# EAGLE design rapport (EAGLE 8.4.3)
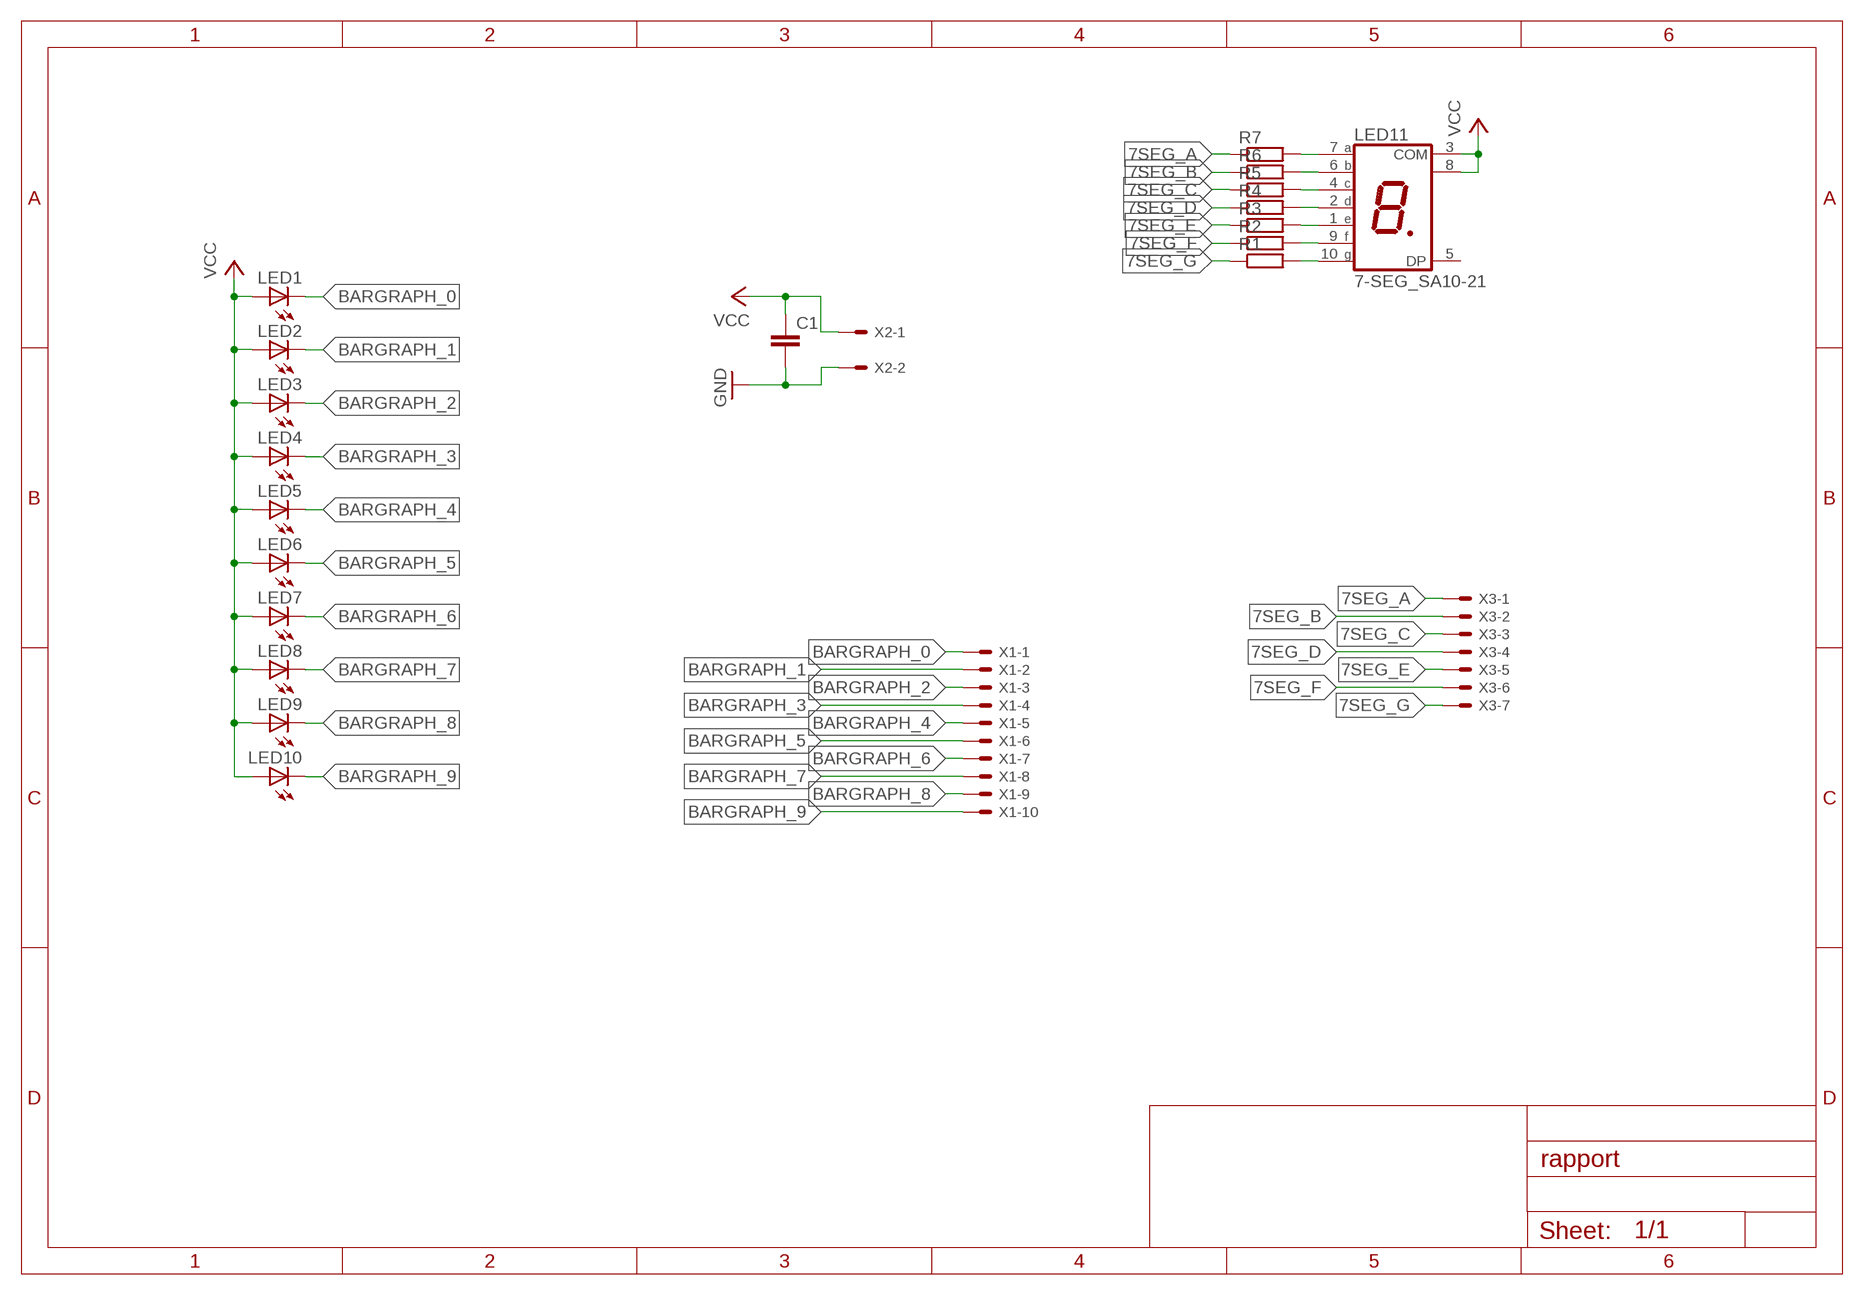
[diagram p0: schematic, sheet 1]

## Parts
C1  C-EU025-030X050  [C025-030X050]
LED1  LED5MM  [LED5MM]
LED2  LED5MM  [LED5MM]
LED3  LED5MM  [LED5MM]
LED4  LED5MM  [LED5MM]
LED5  LED5MM  [LED5MM]
LED6  LED5MM  [LED5MM]
LED7  LED5MM  [LED5MM]
LED8  LED5MM  [LED5MM]
LED9  LED5MM  [LED5MM]
LED10  LED5MM  [LED5MM]
LED11  7-SEG_SA10-21  [SA10-21]
R1  R-EU_0204/7  [0204/7]
R2  R-EU_0204/7  [0204/7]
R3  R-EU_0204/7  [0204/7]
R4  R-EU_0204/7  [0204/7]
R5  R-EU_0204/7  [0204/7]
R6  R-EU_0204/7  [0204/7]
R7  R-EU_0204/7  [0204/7]
X1  KK-156-10  [KK-156-10]
X2  KK-156-2  [KK-156-2]
X3  KK-156-7  [KK-156-7]

## Nets
7SEG_A: R7.1 X3.1
7SEG_B: R6.1 X3.2
7SEG_C: R5.1 X3.3
7SEG_D: R4.1 X3.4
7SEG_E: R3.1 X3.5
7SEG_F: R2.1 X3.6
7SEG_G: R1.1 X3.7
BARGRAPH_0: LED1.K(C) X1.1
BARGRAPH_1: LED2.K(C) X1.2
BARGRAPH_2: LED3.K(C) X1.3
BARGRAPH_3: LED4.K(C) X1.4
BARGRAPH_4: LED5.K(C) X1.5
BARGRAPH_5: LED6.K(C) X1.6
BARGRAPH_6: LED7.K(C) X1.7
BARGRAPH_7: LED8.K(C) X1.8
BARGRAPH_8: LED9.K(C) X1.9
BARGRAPH_9: LED10.K(C) X1.10
GND: C1.2 X2.2
N$2: LED11.7(A) R7.2
N$3: LED11.6(B) R6.2
N$4: LED11.4(C) R5.2
N$5: LED11.2(D) R4.2
N$6: LED11.1(E) R3.2
N$7: LED11.9(F) R2.2
N$8: LED11.10(G) R1.2
VCC: C1.1 LED1.A LED2.A LED3.A LED4.A LED5.A LED6.A LED7.A LED8.A LED9.A LED10.A LED11.3(COM) LED11.8(COM) X2.1
Unconnected: LED11.5(DP)

## Library data of the parts
C1 = rcl:C-EU: CAPACITOR, European symbol
LED1-LED10 = led:LED: LED OSRAM: - CHIPLED LG R971, LG N971, LY N971, LG Q971, LY Q971, LO R971, LY R971 LH N974, LH R974 LS Q976, LO Q976, LY Q976 LO Q996 - Hyper CHIPLED LW Q18S LB Q993, LB Q99A, LB R99A - SideLED LS A670, LO A670, LY A670, LG A670, LP A670 LB A673, LV A673, LT A673, LW A673 LH A674 LY A675 LS A676, LA A676, LO A676, LY A676, LW A676 LS A679, LY A679, LG A679 - Hyper Micro SIDELED® LS Y876, LA Y876, LO Y876, LY Y876 LT Y87S - SmartLED LW L88C, LW L88S LB L89C, LB L89S, LG L890 LS L89K, LO L89K, LY L89K LS L896, LA L896, LO L896, LY L896 - TOPLED LS T670, LO T670, LY T670, LG T670, LP T670 LSG T670, LSP T670, LSY T670, LOP T670, LYG T670 LG T671, LOG T671, LSG T671 LB T673, LV T673, LT T673, LW T673 LH T674 LS T676, LA T676, LO T676, LY T676, LB T676, LH T676, LSB T676, LW T676 LB T67C, LV T67C, LT T67C, LS T67K, LO T67K, LY T67K, LW E67C LS E67B, LA E67B, LO E67B, LY E67B, LB E67C, LV E67C, LT E67C LW T67C LS T679, LY T679, LG T679 LS T770, LO T770, LY T770, LG T770, LP T770 LB T773, LV T773, LT T773, LW T773 LH T774 LS E675, LA E675, LY E675, LS T675 LS T776, LA T776, LO T776, LY T776, LB T776 LHGB T686 LT T68C, LB T68C - Hyper Mini TOPLED® LB M676 - Mini TOPLED Santana® LG M470 LS M47K, LO M47K, LY M47K Source: http://www.osram.convergy.de LUXEON: - LUMILED® LXK2-PW12-R00, LXK2-PW12-S00, LXK2-PW14-U00, LXK2-PW14-V00 LXK2-PM12-R00, LXK2-PM12-S00, LXK2-PM14-U00 LXK2-PE12-Q00, LXK2-PE12-R00, LXK2-PE12-S00, LXK2-PE14-T00, LXK2-PE14-U00 LXK2-PB12-K00, LXK2-PB12-L00, LXK2-PB12-M00, LXK2-PB14-N00, LXK2-PB14-P00, LXK2-PB14-Q00 LXK2-PR12-L00, LXK2-PR12-M00, LXK2-PR14-Q00, LXK2-PR14-R00 LXK2-PD12-Q00, LXK2-PD12-R00, LXK2-PD12-S00 LXK2-PH12-R00, LXK2-PH12-S00 LXK2-PL12-P00, LXK2-PL12-Q00, LXK2-PL12-R00 Source: www.luxeon.com KINGBRIGHT: KA-3528ASYC Source: www.kingbright.com
LED11 = display-kingbright:7-SEG_: Kingbright 14.2mm (0.56 INCH) SINGLE DIGIT NUMERIC DUISPLAY Source: SA56-11EWA(Ver1189471036.pdf; OC_FARNELL: unknown; OC_NEWARK: unknown
R1-R7 = resistor:R-EU_: RESISTOR, European symbol
X1 = con-molex:KK-156-10: KK 156 HEADER Source: http://www.molex.com/pdm_docs/sd/026604100_sd.pdf; OC_FARNELL: unknown; OC_NEWARK: unknown
X2 = con-molex:KK-156-2: KK 156 HEADER Source: http://www.molex.com/pdm_docs/sd/026604100_sd.pdf; OC_FARNELL: unknown; OC_NEWARK: unknown
X3 = con-molex:KK-156-7: KK 156 HEADER Source: http://www.molex.com/pdm_docs/sd/026604100_sd.pdf; OC_FARNELL: unknown; OC_NEWARK: unknown

## Board
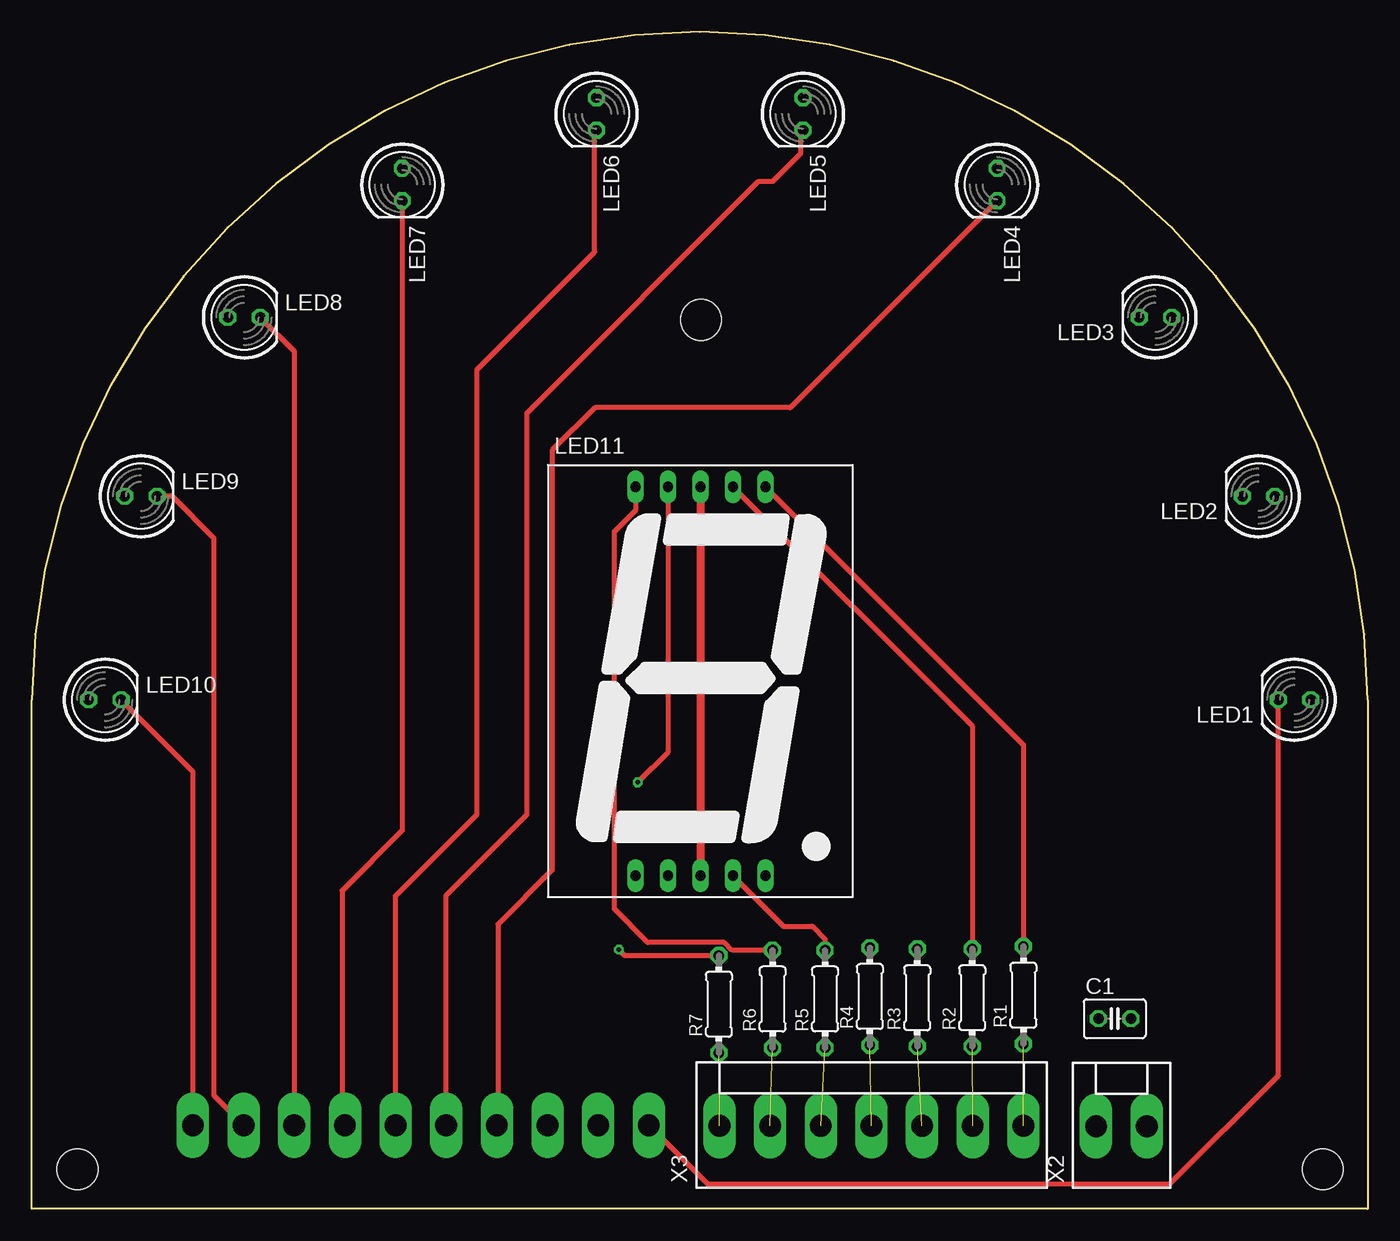
[diagram p1: board, top side]
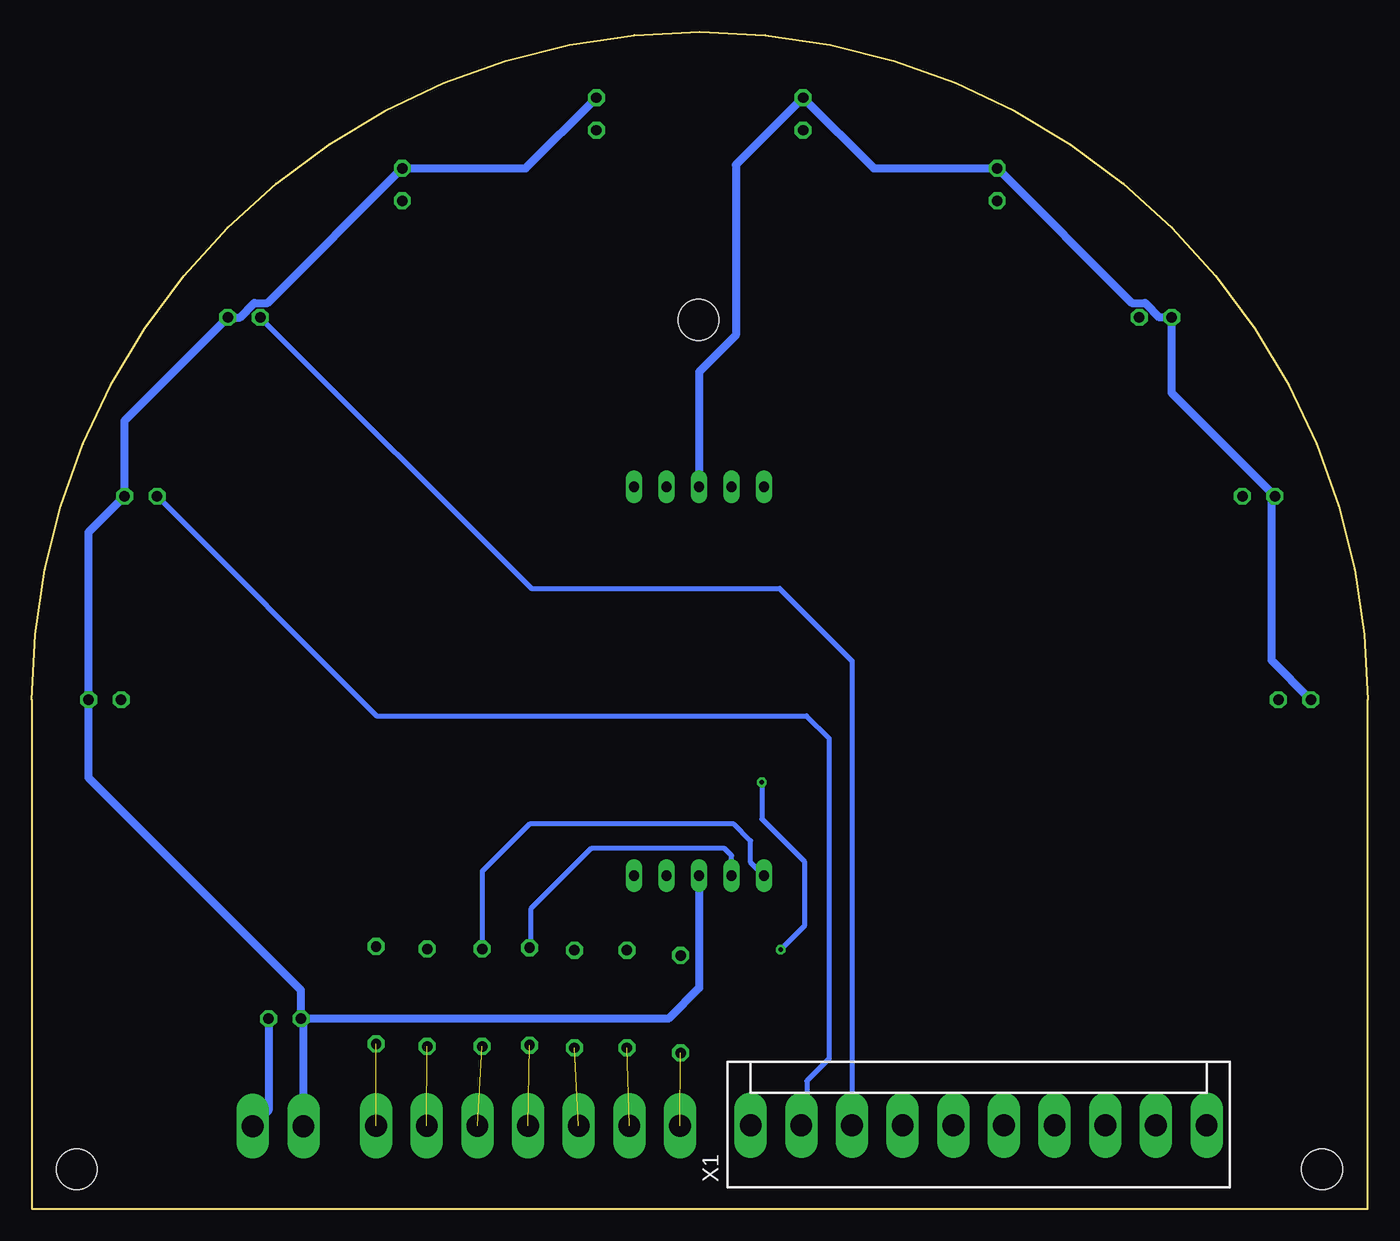
[diagram p2: board, bottom side, seen from below]

Size 104.4 x 92 mm. Coordinates in mm from the lower left corner, seen from the top.
Outline: 104.4,39.8 arc180 0,39.8 0,0 104.4,0 104.4,39.8
Copper layers (1*16): Top 0.035mm / dielectric 1.5mm / Bottom 0.035mm
Design rules "default": minimum track width 6mil, minimum drill 0.35mm, track to track 6mil, track to pad 6mil, pad to pad 6mil, via to via 6mil, smd to smd 6mil, copper to edge 40mil, drill to drill 6mil, minimum pad ring 10mil, minimum via ring 8mil, stop-mask expansion 4mil, vias tented up to drill 0mil, thermal gap 10mil
Holes 3.2 mm at 100.9,3.1 3.56,3.1 52.3,69.5

### Footprints (pad centres in the part's own frame; a part is rotated, then mirrored left to right if it is on the bottom)
C025-030X050 = drill 0.813 octagon: 1 -1.27,0; 2 1.27,0
LED5MM = drill 0.813 octagon: A -1.27,0; K 1.27,0
SA10-21 = drill 0.8 long: 1 -5.08,-15.2; 2 -2.54,-15.2; 3 0,-15.2; 4 2.54,-15.2; 5 5.08,-15.2; 6 -5.08,15.2; 7 -2.54,15.2; 8 0,15.2; 9 2.54,15.2; 10 5.08,15.2
0204/7 = drill 0.813 octagon: 1 -3.81,0; 2 3.81,0
KK-156-10 = drill 1.7 pad 2.184 long: 1 -17.82,0; 2 -13.86,0; 3 -9.9,0; 4 -5.94,0; 5 -1.98,0; 6 1.98,0; 7 5.94,0; 8 9.9,0; 9 13.86,0; 10 17.82,0
KK-156-2 = drill 1.7 pad 2.184 long: 1 -1.98,0; 2 1.98,0
KK-156-7 = drill 1.7 pad 2.184 long: 1 -11.88,0; 2 -7.92,0; 3 -3.96,0; 4 0,0; 5 3.96,0; 6 7.92,0; 7 11.88,0

### Placement (x,y rotation side)
C1  84.64,14.87 0 top
LED1  98.7,39.8 180 top
LED2  95.9,55.7 180 top
LED3  87.82,69.69 180 top
LED4  75.45,80.07 270 top
LED5  60.27,85.59 270 top
LED6  44.13,85.59 270 top
LED7  28.95,80.07 270 top
LED8  16.58,69.69 0 top
LED9  8.5,55.7 0 top
LED10  5.7,39.8 0 top
LED11  52.25,41.24 0 top
R1  77.5,16.7 90 top
R2  73.5,16.5 90 top
R3  69.2,16.5 90 top
R4  65.5,16.6 90 top
R5  62,16.4 90 top
R6  57.9,16.4 90 top
R7  53.7,16 90 top
X1  30.4,6.53 0 bottom
X2  85.16,6.46 0 top
X3  65.62,6.49 0 top

### Tracks (layer width: path | path; a pad name or v marks a point on that pad's centre or on a via)
7SEG_A  (1 unrouted)
7SEG_B  (1 unrouted)
7SEG_C  (1 unrouted)
7SEG_D  (1 unrouted)
7SEG_E  (1 unrouted)
7SEG_F  (1 unrouted)
7SEG_G  (1 unrouted)
BARGRAPH_0
  Top 0.406: X1.1 52.8,1.95 88.96,1.95 97.43,10.42 LED1.K
BARGRAPH_1
  Bottom 0.406: LED2.K 77.47,38.55 43.85,38.55 42.1,36.8 42.1,11.72 43.82,10 43.82,6.44 44.36,5.91 44.36,6.43 X1.2
BARGRAPH_2
  Bottom 0.406: LED3.K 65.37,48.5 45.96,48.5 40.3,42.85 X1.3
BARGRAPH_3
  Top 0.406: LED4.K 59.28,62.63 44,62.63 40.67,59.3 40.67,26.48 36.43,22.24 36.43,6.62 X1.4
BARGRAPH_4
  Top 0.406: X1.5 32.38,24.51 38.69,30.83 38.69,62.22 56.8,80.33 57.92,80.33 60.1,82.52 60.1,84.15 LED5.K
BARGRAPH_5
  Top 0.406: X1.6 28.42,24.47 34.78,30.83 34.78,65.6 43.98,74.79 43.98,84.17 LED6.K
BARGRAPH_6
  Top 0.406: LED7.K 28.95,29.57 24.24,24.86 24.24,6.75 X1.7
BARGRAPH_7
  Top 0.406: LED8.K 20.5,67.04 X1.8
BARGRAPH_8
  Top 0.406: X1.9 14.23,8.84 14.23,52.42 10.94,55.7 LED9.K
BARGRAPH_9
  Top 0.406: LED10.K 12.58,34.19 X1.10
GND
  Bottom 0.61: C1.2 85.91,7.69 X2.2
N$2  (via drill 0.35)
  Top 0.406: LED11.7 49.71,35.7 v47.35,33.34 | v45.88,20.26 46.33,19.81 R7.2
  Bottom 0.406: v47.35,33.34 47.35,30.47 44.03,27.14 44.03,22.11 v45.88,20.26
N$3
  Top 0.406: R6.2 54.74,20.21 54.12,20.83 48.13,20.83 45.52,23.44 45.52,52.95 47.2,54.63 47.2,56.41 LED11.6
N$4
  Top 0.406: LED11.4 58.74,22.09 60.99,22.09 62,21.08 R5.2
N$5
  Bottom 0.406: LED11.2 49.71,27.62 50.25,28.16 60.69,28.16 65.41,23.44 65.41,20.5 R4.2
N$6
  Bottom 0.406: LED11.1 48.22,27.09 48.22,28.77 49.54,30.09 65.49,30.09 69.2,26.38 R3.2
N$7
  Top 0.406: LED11.9 73.5,37.73 R2.2
N$8
  Top 0.406: LED11.10 77.5,36.27 R1.2
VCC
  Top 0.61: LED11.8 LED11.3
  Bottom 0.61: X2.1 83.18,14.68 C1.1 | C1.1 83.37,17.08 99.98,33.7 99.98,39.79 LED1.A 99.97,52.9 LED2.A 97.17,61.61 LED3.A 88.13,69.69 87.01,70.81 85.98,70.81 LED4.A 65.8,81.34 LED5.A | LED11.8 52.25,65.42 49.38,68.29 49.38,81.61 LED6.A 38.6,81.34 LED7.A 18.42,70.81 17.39,70.81 16.27,69.69 LED8.A 15.31,63.78 7.5,55.97 | 7.5,55.97 LED9.A | LED10.A 7.5,42.87 7.5,55.97 | LED11.3 52.25,17.27 54.65,14.87 C1.1